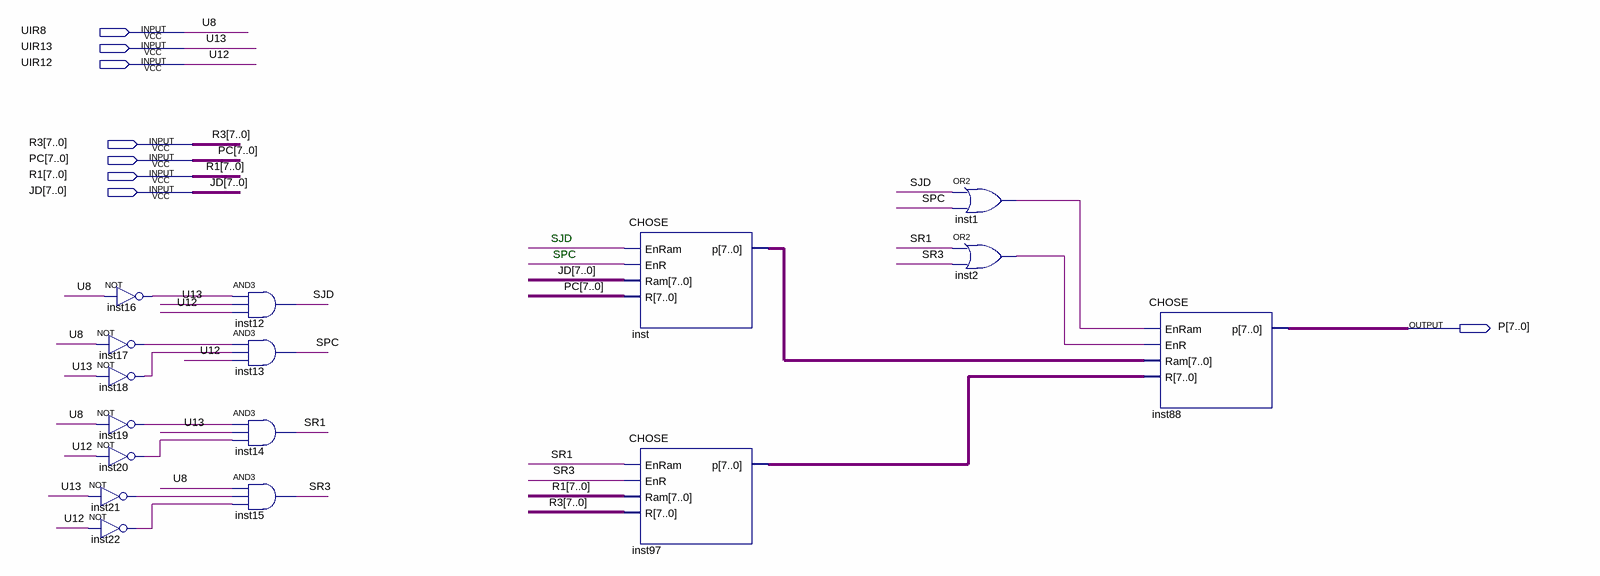
[diagram p0: schematic sheet]
// Quartus schematic CH41.bdf as structural Verilog: 16 symbols, 8 pins
module CH41 (
  input  UIR8,
  input  UIR13,
  input  UIR12,
  input  [7:0] R3,
  input  [7:0] PC,
  input  [7:0] R1,
  input  [7:0] JD,
  output [7:0] P
);

  wire inst1_out, inst2_out, inst16_out, inst17_out, inst18_out, inst19_out, inst20_out, inst21_out,
       inst22_out, SJD, SPC, SR1, SR3;
  wire [7:0] inst97_p, inst_p;

  not inst16 (inst16_out, UIR8);
  not inst17 (inst17_out, UIR8);
  not inst18 (inst18_out, UIR13);
  not inst19 (inst19_out, UIR8);
  not inst20 (inst20_out, UIR12);
  not inst21 (inst21_out, UIR13);
  not inst22 (inst22_out, UIR12);
  and inst12 (SJD, inst16_out, UIR13, UIR12);
  and inst13 (SPC, inst17_out, inst18_out, UIR12);
  and inst14 (SR1, inst19_out, UIR13, inst20_out);
  and inst15 (SR3, UIR8, inst21_out, inst22_out);
  CHOSE inst (.EnRam(SJD), .EnR(SPC), .Ram(JD), .R(PC), .p(inst_p));
  CHOSE inst97 (.EnRam(SR1), .EnR(SR3), .Ram(R1), .R(R3), .p(inst97_p));
  or inst1 (inst1_out, SJD, SPC);
  or inst2 (inst2_out, SR1, SR3);
  CHOSE inst88 (.EnRam(inst1_out), .EnR(inst2_out), .Ram(inst_p), .R(inst97_p), .p(P));

  // Other names for the same wires on the sheet: U8 = UIR8; U12 = UIR12; U13 = UIR13

  // Notes on the sheet:
  //   SJD
  //   SPC
endmodule
